# Altium schematic sheet Micro SD.SchDoc
size A4; SheetNumber: 10; SheetTotal: 11; TitleBlk1Sch: PCBA, LUCHADOR, REV 3.2b, AMBER; Eng: Haman; TitleBlk2Sch: Micro SD; EngDate: 3-15-19; RevSch: 01
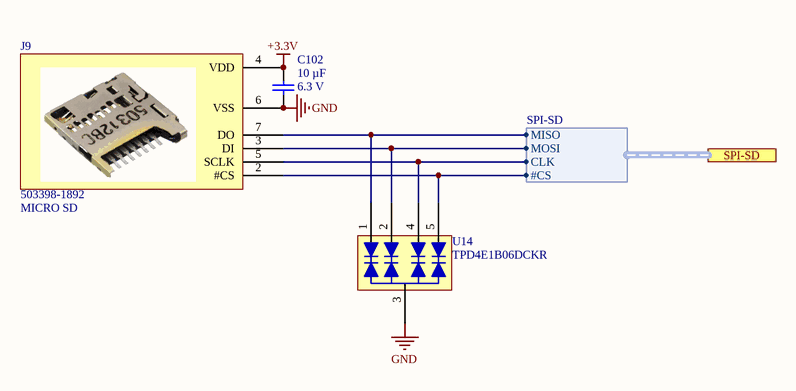
[diagram p0: Micro SD.SchDoc]

## Parts
C102  Capacitance: 10 µF  Rated Voltage: 6.3 V  [0603C]  (hidden comment: 50V)
J9  MICRO SD  [503398-1892]
U14  TPD4E1B06DCKR  [SC70-6]

## Ports
SPI-SD (harness SPI-SD)

## Harnesses
SPI-SD: MISO, MOSI, CLK, #CS

## Nets
+3.3V: C102.1 J9.4(VDD)
GND: C102.2 J9.6(VSS) U14.3(GND)
NetJ9_2: J9.2(#CS) U14.5(IO4) ; port SPI-SD.#CS
NetJ9_3: J9.3(DI) U14.2(IO2) ; port SPI-SD.MOSI
NetJ9_5: J9.5(SCLK) U14.4(IO3) ; port SPI-SD.CLK
NetJ9_7: J9.7(DO) U14.1(IO1) ; port SPI-SD.MISO

## Notes on the sheet
- Title:
- USA
- 100 Mayfield Avenue
- Mountain View, CA 94043
- Variant Name:
- Confidential and Proprietary
- Engineer:
- Date:
- Size:
- A4
- Template:
- 992-00283-00 A
- Dwg No:
- Sheet:
- Rev:
- of

## Library data of the parts
C102 = Cap: CAP .1UF 50V CERAMIC Y5V 0805; Manufacturer: Samsung; Manufacturer Part Number: CL10B106MQ8NRNC; Description1: 10µF ±20% 6.3V X7R Ceramic Capacitor -55°C ~ 125°C Surface Mount, MLCC 0603 (1608 Metric) 0.063" L x 0.031" W (1.60mm x 0.80mm); Dielectric: X7R; Tolerance (%): ±20 %; Revision: July-2002: Re-released for DXP Platform.; Supplier 1: Digi-Key; Supplier Part Number 1: 1276-1948-1-ND; Stock 1: 40000; Pricing 1: 1=1.07, 10=0.813, 100=0.5813, 500=0.45, 1000=0.3875 (USD); Case Size/Dimension: 0603; ComponentLink1URL: https://datasheet.ciiva.com/25723/cl10b106mq8nrnc-25723233.pdf; ComponentLink1Description: https://datasheet.ciiva.com/25723/cl10b106mq8nrnc-25723233.pdf; ComponentLink2URL: https://datasheet.ciiva.com/16428/cl10b106mq8nrnc-16428858.pdf; ComponentLink2Description: https://datasheet.ciiva.com/16428/cl10b106mq8nrnc-16428858.pdf
J9 = 503398-1892: Manufacturer: Molex; Description1: Conn Micro SD Card SKT 8 POS 1.1mm Solder RA SMD 0.5A/Contact Embossed T/R; Current Rating: 500 mA; Voltage Rating: 10 VAC/DC; Supplier 1: Digi-Key; Supplier Part Number 1: WM11190CT-ND; Stock 1: 31833; Pricing 1: 1=2.53, 10=2.292, 25=2.1516, 50=2.0582, 100=1.9647, 250=1.7776, 500=1.6372, 1000=1.4033 (USD); Product Category: Memory Card Connectors; RoHS: Details; Brand: Molex; Packaging: Reel; Series: 503398; Factory Pack Quantity: 2400; ComponentLink1URL: https://datasheet.ciiva.com/23941/1740947-23941665.pdf; ComponentLink1Description: https://datasheet.ciiva.com/23941/1740947-23941665.pdf; ComponentLink2URL: https://datasheet.ciiva.com/16655/5033981892-memory-card-socket-16655604.pdf; ComponentLink2Description: https://datasheet.ciiva.com/16655/5033981892-memory-card-socket-16655604.pdf; ComponentLink3URL: https://datasheet.ciiva.com/29723/5033981892-sd-29723401.pdf; ComponentLink3Description: https://datasheet.ciiva.com/29723/5033981892-sd-29723401.pdf; ComponentLink4URL: https://datasheet.ciiva.com/22744/1740946-22744573.pdf; ComponentLink4Description: https://datasheet.ciiva.com/22744/1740946-22744573.pdf; Manufacturer Part Number: 503398-1892
U14 = TPD4E1B06DCKR: Manufacturer: Texas Instruments; Description1: TVS DIODE 5.5VWM 14.5VC SC70-6; Direction Type: Uni-Directional; Maximum Clamping Voltage: 15(Typ) V; Number of Elements per Chip: 4; ESD Protection Voltage: ±18@Air Gap/±18@Contact Disc kV; Maximum Working Voltage: 5.5 V; Maximum Leakage Current: 0.01 uA; Capacitance Value: 1 pF; Supplier 1: Digi-Key; Supplier Part Number 1: 296-39346-1-ND; Stock 1: 120901; Pricing 1: 1=0.61, 10=0.519, 100=0.3876, 500=0.3046, 1000=0.2353 (USD); Type: Diode Arrays; Pin Count: 6; Minimum Operating Temperature: -40 °C; Maximum Operating Temperature: 125 °C; Mounting: Surface Mount; Category: ESD Suppressors; ComponentLink1URL: https://datasheet.ciiva.com/12545/tpd4e1b06-224687-12545147.pdf; ComponentLink1Description: https://datasheet.ciiva.com/12545/tpd4e1b06-224687-12545147.pdf; ComponentLink2URL: https://datasheet.ciiva.com/6574/tpd4e1b06-6574671.pdf; ComponentLink2Description: https://datasheet.ciiva.com/6574/tpd4e1b06-6574671.pdf; Manufacturer Part Number: TPD4E1B06DCKR